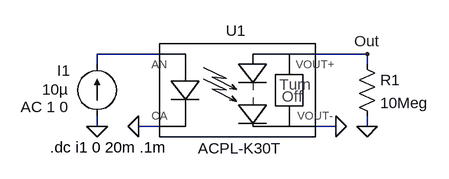
[diagram p0: schematic ACPL-K30T_DC.asc]
ACPL-K30T_DC.asc, the LTspice schematic file:
Version 4
SHEET 1 896 680
WIRE 176 32 80 32
WIRE 496 32 416 32
WIRE 80 48 80 32
WIRE 496 48 496 32
WIRE 80 144 80 128
WIRE 176 144 144 144
WIRE 448 144 416 144
WIRE 496 144 496 128
FLAG 144 144 0
FLAG 80 144 0
FLAG 448 144 0
FLAG 496 144 0
FLAG 496 32 Out
SYMBOL current 80 128 R180
WINDOW 0 41 70 Left 2
WINDOW 3 44 41 Left 2
WINDOW 123 44 14 Left 2
WINDOW 39 0 0 Left 0
SYMATTR InstName I1
SYMATTR Value 10µ
SYMATTR Value2 AC 1 0
SYMBOL res 480 32 R0
SYMATTR InstName R1
SYMATTR Value 10Meg
SYMBOL ACPL-K30T 272 96 R0
SYMATTR InstName U1
TEXT 8 176 Left 2 !.dc i1 0 20m .1m

The netlist it stands for:
* ACPL-K30T_DC.asc
I1 0 N001 10µ AC 1 0
R1 Out 0 10Meg
XU1 N001 0 Out 0 ACPL-K30T ACPL-K30T  ; pins AN CA VOUT+ VOUT-
.dc i1 0 20m .1m
.lib ACPL-K30T.cir
.backanno
.end